# EAGLE design epaper-watch (EAGLE 9.1.0)
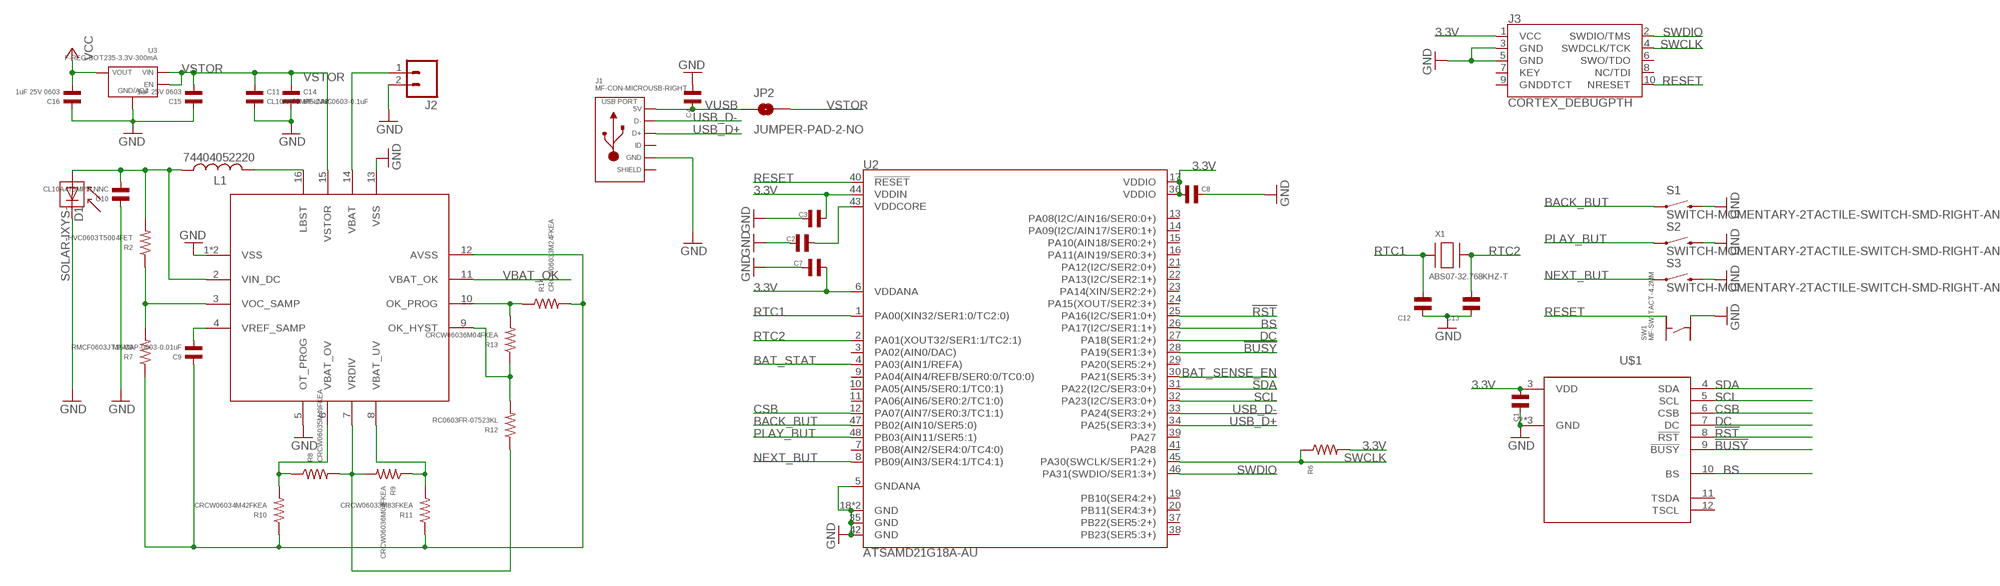
[diagram p0: schematic, sheet 1]

## Parts
C1  0.1uF 0603  CAPACITOR_NP_0603  [C0603]
C2  1uF 0603  CAPACITOR_NP_0603  [C0603]
C3  0.1uF 0603  CAPACITOR_NP_0603  [C0603]
C4  0.1uF 0603  CAPACITOR_NP_0603  [C0603]
C7  0.1uF 0603  CAPACITOR_NP_0603  [C0603]
C8  0.1uF 0603  CAPACITOR_NP_0603  [C0603]
C9  MF-CAP-0603-0.01uF  CAPACITOR_NP_0603  [C0603]
C10  CL10A475MP5LNNC  CAPACITOR_NP_0603  [C0603]
C11  CL10A475MP5LNNC  CAPACITOR_NP_0603  [C0603]
C12  15pF  CAPACITOR_NP_0603  [C0603]
C13  15pF  CAPACITOR_NP_0603  [C0603]
C14  MF-CAP-0603-0.1uF  CAPACITOR_NP_0603  [C0603]
C15  1uF 25V 0603  CAPACITOR_NP_0603  [C0603]
C16  1uF 25V 0603  CAPACITOR_NP_0603  [C0603]
D1  SOLAR-IXYS-  [SOLARBIT-12X1]
J1  MF-CON-MICROUSB-RIGHT  USB_MICRO_RIGHT  [MICROUSB-RIGHT]
J2  M02PTH  [1X02]
J3  CORTEX_DEBUGPTH  [2X5-PTH-1.27MM]
JP2  JUMPER-PAD-2-NO  [PAD-JUMPER-2-NO_NO_SILK]
L1  74404052220  L-USWE-TPC  [POWER-CHOKE_WE-TPC]
R2  HVC0603T5004FET  RESISTOR_0603  [R0603]
R6  1K  RESISTOR_0603  [R0603]
R7  RMCF0603JT15M0  RESISTOR_0603  [R0603]
R8  CRCW06035M49FKEA  RESISTOR_0603  [R0603]
R9  CRCW06036M04FKEA  RESISTOR_0603  [R0603]
R10  CRCW06034M42FKEA  RESISTOR_0603  [R0603]
R11  CRCW06033M83FKEA  RESISTOR_0603  [R0603]
R12  RC0603FR-07523KL  RESISTOR_0603  [R0603]
R13  CRCW06036M04FKEA  RESISTOR_0603  [R0603]
R14  CRCW06033M24FKEA  RESISTOR_0603  [R0603]
S1  SWITCH-MOMENTARY-2TACTILE-SWITCH-SMD-RIGHT-ANGLE  [TACTILE_SWITCH-SMD-RIGHT-ANGLE]
S2  SWITCH-MOMENTARY-2TACTILE-SWITCH-SMD-RIGHT-ANGLE  [TACTILE_SWITCH-SMD-RIGHT-ANGLE]
S3  SWITCH-MOMENTARY-2TACTILE-SWITCH-SMD-RIGHT-ANGLE  [TACTILE_SWITCH-SMD-RIGHT-ANGLE]
SW1  MF-SW-TACT-4.2MM  TACT_4.2MM  [TACT4.2MM]
U1  BQ25504RGTT  BQ25504  [QFN16-3X3MM_1:1_V03]
U2  ATSAMD21G18A-AU  ATSAMD21G-M  [QFN-48]
U3  F-REG-SOT235-3.3V-300mA  TLV70233PDBVR  [SOT-23-5]
U$1  GDEP011TT2  [FH26W-15S-0.3S]
X1  ABS07-32.768KHZ-T  XTAL-3.2X1.5  [XTAL3215]

## Nets
3.3V: C1.P$2 C3.P$2 C7.P$2 C8.P$2 J3.1(VCC) R6.P$2 U2.6(VDDANA) U2.17(VDDIO) U2.36(VDDIO) U2.44(VDDIN) U$1.3(VDD)
!BUSY: U2.28(PA19(SER1:3+)) U$1.9(!BUSY)
!RST: U2.25(PA16(I2C/SER1:0+)) U$1.8(!RST)
BACK_BUT: S1.1 U2.47(PB02(AIN10/SER5:0))
BAT_SENSE_EN: U2.30(PA21(SER5:3+))
BAT_STAT: U2.4(PA03(AIN1/REFA))
BS: U2.26(PA17(I2C/SER1:1+)) U$1.10(BS)
CSB: U2.12(PA07(AIN7/SER0:3/TC1:1)) U$1.6(CSB)
DC: U2.27(PA18(SER1:2+)) U$1.7(DC)
GND: C1.P$1 C2.P$2 C3.P$1 C4.P$2 C7.P$1 C8.P$1 C10.P$1 C11.P$2 C12.P$1 C13.P$1 C14.P$2 C15.P$1 C16.P$1 D1.-(C) J1.5(GND) J2.2 J3.3(GND) J3.5(GND) S1.2 S2.2 S3.2 SW1.P$4 U1.1(VSS) U1.5(OT_PROG) U1.13(VSS) U1.EXT(VSS) U2.5(GNDANA) U2.18(GND) U2.35(GND) U2.42(GND) U2.EP(GND) U3.P$2(GND/ADJ) U$1.2(GND) U$1.EXP1(GND) U$1.EXP2(GND)
N$1: C9.P$2 U1.4(VREF_SAMP)
N$2: L1.2 U1.16(LBST)
N$3: R12.P$2 R13.P$1 U1.9(OK_HYST)
N$4: C9.P$1 R7.P$1 R10.P$1 R11.P$1 R14.P$2 U1.12(AVSS)
N$8: C2.P$1 U2.43(VDDCORE)
N$10: R13.P$2 R14.P$1 U1.10(OK_PROG)
N$12: R8.P$2 R9.P$2 R12.P$1 U1.7(VRDIV)
N$13: R9.P$1 R11.P$2 U1.8(VBAT_UV)
N$14: R8.P$1 R10.P$2 U1.6(VBAT_OV)
N$18: R2.P$1 R7.P$2 U1.3(VOC_SAMP)
NEXT_BUT: S3.1 U2.8(PB09(AIN3/SER4:1/TC4:1))
PLAY_BUT: S2.1 U2.48(PB03(AIN11/SER5:1))
RESET: J3.10(NRESET) SW1.P$2 U2.40(!RESET!)
RTC1: C12.P$2 U2.1(PA00(XIN32/SER1:0/TC2:0)) X1.P$1
RTC2: C13.P$2 U2.2(PA01(XOUT32/SER1:1/TC2:1)) X1.P$2
SCL: U2.32(PA23(I2C/SER3:0+)) U$1.5(SCL)
SDA: U2.31(PA22(I2C/SER3:0+)) U$1.4(SDA)
SOLAR_IN: C10.P$2 D1.+(A) L1.1 R2.P$2 U1.2(VIN_DC)
SWCLK: J3.4(SWDCLK/TCK) R6.P$1 U2.45(PA30(SWCLK/SER1:2+))
SWDIO: J3.2(SWDIO/TMS) U2.46(PA31(SWDIO/SER1:3+))
USB_D+: J1.3(D+) U2.34(PA25(SER3:3+))
USB_D-: J1.2(D-) U2.33(PA24(SER3:2+))
VBAT: J2.1 U1.14(VBAT)
VBAT_OK: U1.11(VBAT_OK)
VCC [power]: C16.P$2 U3.P$5(VOUT)
VSTOR [power]: C11.P$1 C14.P$1 C15.P$2 JP2.2 U1.15(VSTOR) U3.P$1(VIN) U3.P$3(EN)
VUSB: C4.P$1 J1.1(5V) JP2.1
Unconnected: J1.4(ID) J3.6(SWO/TDO) J3.7(KEY) J3.8(NC/TDI) J3.9(GNDDTCT) SW1.P$1 SW1.P$3 U2.3(PA02(AIN0/DAC)) U2.7(PB08(AIN2/SER4:0/TC4:0)) U2.9(PA04(AIN4/REFB/SER0:0/TC0:0)) U2.10(PA05(AIN5/SER0:1/TC0:1)) U2.11(PA06(AIN6/SER0:2/TC1:0)) U2.13(PA08(I2C/AIN16/SER0:0+)) U2.14(PA09(I2C/AIN17/SER0:1+)) U2.15(PA10(AIN18/SER0:2+)) U2.16(PA11(AIN19/SER0:3+)) U2.19(PB10(SER4:2+)) U2.20(PB11(SER4:3+)) U2.21(PA12(I2C/SER2:0+)) U2.22(PA13(I2C/SER2:1+)) U2.23(PA14(XIN/SER2:2+)) U2.24(PA15(XOUT/SER2:3+)) U2.29(PA20(SER5:2+)) U2.37(PB22(SER5:2+)) U2.38(PB23(SER5:3+)) U2.39(PA27) U2.41(PA28) U$1.11(TSDA) U$1.12(TSCL)

## Power pins joined to a net without a drawn wire
SLD: J1.S1(SLD)

## Library data of the parts
C1-C4 C7-C16 = MF_Passives:CAPACITOR_NP: Library: MF_Passives Description: Device for Non-Polarized Capacitors. Manufacture part number (MPN) can be added via Attributes. Check https://factory.macrofab.com/parts for the house parts list.; POPULATE: 1
D1 = SparkFun-Sensors:SOLAR-IXYS
J1 = MF_Connectors:USB: Library: MF_Connectors Description: 5 Pin USB Connectors. SLD is the shield connection. Usually tied to ground through a small ferrite bead.; HOUSEPART: YES; MPN: MF-CON-MICROUSB-RIGHT; POPULATE: 1; URL: https://factory.macrofab.com/part/MF-CON-MICROUSB-RIGHT
J2 = SparkFun-Connectors:M02: Standard 2-pin 0.1" header. Use with - straight break away headers ( PRT-00116) - right angle break away headers (PRT-00553) - swiss pins (PRT-00743) - machine pins (PRT-00117) - female headers (PRT-00115) Molex polarized connector foot print use with: PRT-08233 with associated crimp pins and housings. 2.54_SCREWTERM for use with PRT-10571. 3.5mm Screw Terminal footprints for PRT-08084 5mm Screw Terminal footprints for use with PRT-08432
J3 = SparkFun-Connectors:CORTEX_DEBUG: Cortex Debug Connector Datasheet <http://infocenter.arm.com/help/topic/com.arm.doc.faqs/attached/13634/cortex_debug_connectors.pdf>
JP2 = SparkFun-Passives:JUMPER-PAD-2-NO
L1 = rcl:L-US: INDUCTOR, American symbol
R2 R6-R14 = MF_Passives:RESISTOR: Library: MF_Passives Description: Device for Resistors. Manufacture part number (MPN), Voltage, Tolerance, and Wattage Rating can be added via Attributes. Check https://factory.macrofab.com/parts for the house parts list.; POPULATE: 1
S1-S3 = SparkFun-Electromechanical:SWITCH-MOMENTARY-2: Various NO switches- pushbuttons, reed, etc; PROD_ID: COMP-12265
SW1 = MF_Switches:TACT: Library: MF_Switches Description: Device for Tact Switches. Manufacture part number (MFG#) can be added via Attributes.; HOUSEPART: YES; MPN: MF-SW-TACT-4.2MM; POPULATE: 1; URL: https://factory.macrofab.com/part/MF-SW-TACT-4.2MM
U1 = sonik:BQ25504
U2 = SparkFun-DigitalIC:ATSAMD21G: Atmel SAMD21G SMART ARM-Based Microcontroller The Atmel ® | SMART ™ SAM D21 is a series of low-power microcontrollers using the 32-bit ARM ® Cortex ® -M0+ processor, and ranging from 32- to 64-pins with up to 256KB Flash and 32KB of SRAM. The SAM D21 devices operate at a maximum frequency of 48MHz and reach 2.46 CoreMark/MHz. They are designed for simple and intuitive migration with identical peripheral modules, hex compatible code, identical linear address map and pin compatible migration paths between all devices in the product series. All devices include intelligent and flexible peripherals, Atmel Event System for inter-peripheral signaling, and support for capacitive touch button, slider and wheel user interfaces.; PROD_ID: IC-13064
U3 = MF_IC_Power:TLV702: Manufacturer Part #: TLV702 Manufacturer: Texas Instruments Description: LDO Voltage Regulators; HOUSEPART: YES; MPN: F-REG-SOT235-3.3V-300mA; POPULATE: 1; URL: https://factory.macrofab.com/part/MF-REG-SOT235-3.3V-300mA
U$1 = sonik:GDEP011TT2
X1 = adafruit:XTAL: Low cost SMT crystals, no capacitors included http://www.ladyada.net/library/eagle

## Board
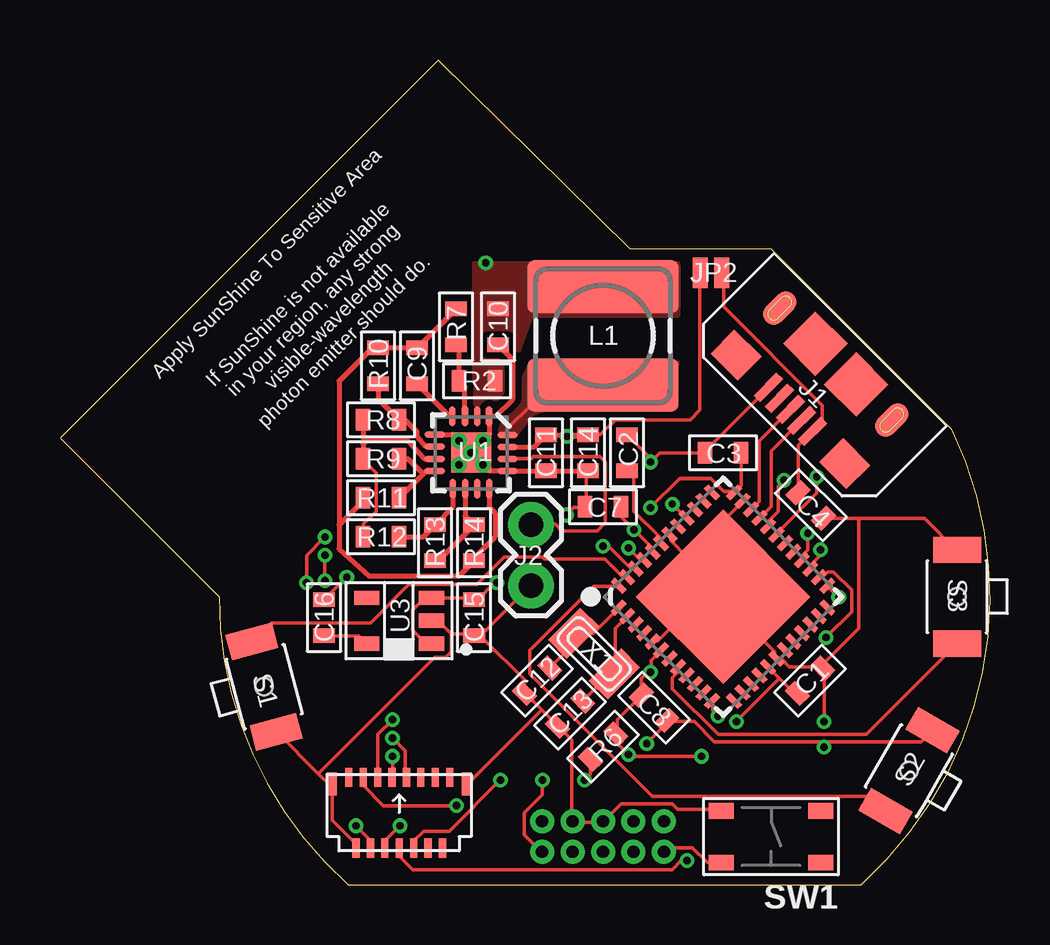
[diagram p1: board, top side]
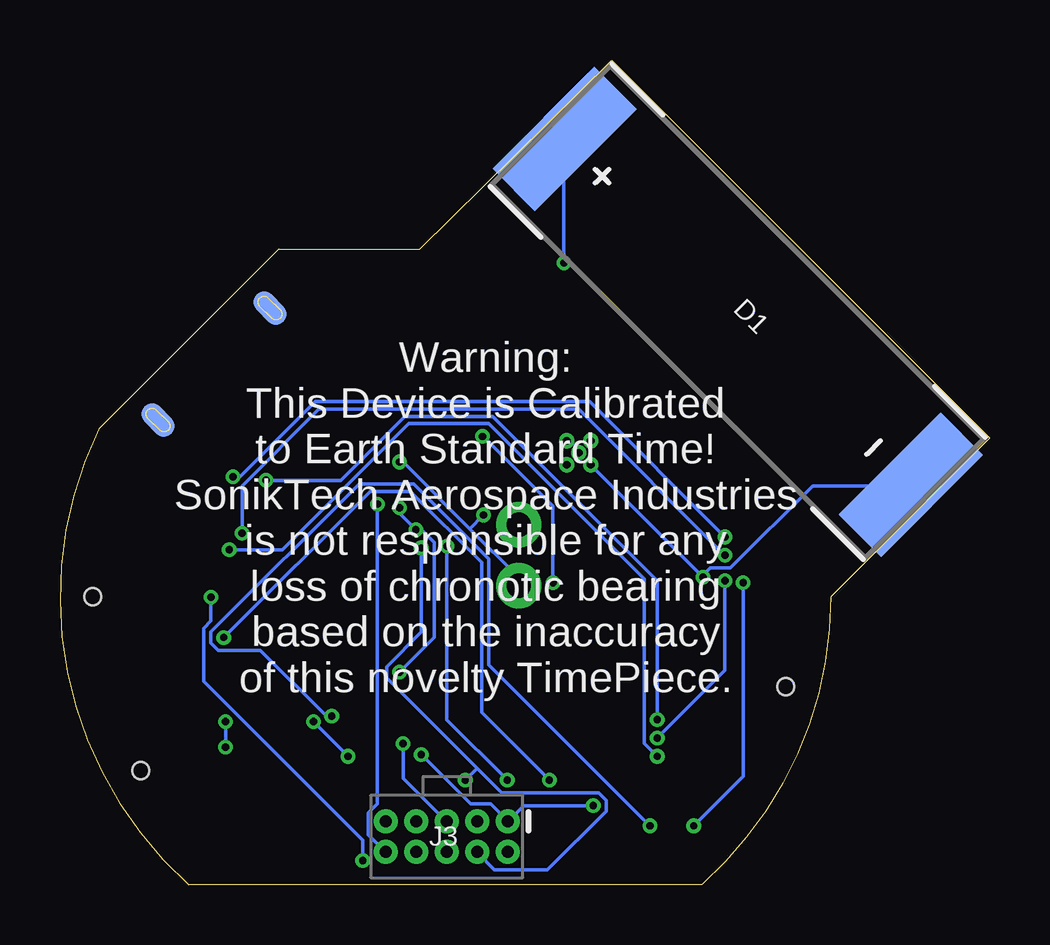
[diagram p2: board, bottom side, seen from below]

Size 38.74 x 34.38 mm. Coordinates in mm from the lower left corner, seen from the top.
Outline: 29.62,26.5 37.12,19 arc-74 33.38,0 12,0 arc-48 6.62,12 0,18.62 15.75,34.38 23.75,26.5 29.62,26.5
Copper layers (1*16): Top 0.035mm / dielectric 1.5mm / Bottom 0.035mm
Design rules "MF_Standard_2_Layer_6mil": minimum track width 6mil, minimum drill 12mil, track to track 6mil, track to pad 6mil, pad to pad 5mil, via to via 6mil, smd to smd 0mil, copper to edge 20mil, drill to drill 10mil, minimum pad ring 6mil, minimum via ring 6mil, stop-mask expansion 2mil, vias tented up to drill 25mil, thermal gap 10mil

### Footprints (pad centres in the part's own frame; a part is rotated, then mirrored left to right if it is on the bottom)
C0603 = smd 0.6 x 0.9: P$1 -0.75,0; P$2 0.75,0
SOLARBIT-12X1 = smd 2.5 x 6: + -10.2,0; - 10.2,0
MICROUSB-RIGHT = smd 0.4 x 1.35: 1 -1.3,1.27; 2 -0.65,1.27; 3 0,1.27; 4 0.65,1.27; 5 1.3,1.27 | smd 0.9 x 1.6: S1 -3.3,-1.4; S2 3.3,-1.4 | smd 1.6 x 1.4: S3 -3.2,1.27; S4 3.2,1.27 | smd 1.9 x 1.9: S5 -1.2,-1.405; S6 1.2,-1.405 | smd 0.9 x 1.6 bottom: S7 -3.3,-1.4; S8 3.3,-1.4
1X02 = drill 1.016 pad 1.88: 1 0,0; 2 2.54,0
2X5-PTH-1.27MM = drill 0.508 pad 1: 1 -2.54,-0.635; 2 -2.54,0.635; 3 -1.27,-0.635; 4 -1.27,0.635; 5 0,-0.635; 6 0,0.635; 7 1.27,-0.635; 8 1.27,0.635; 9 2.54,-0.635; 10 2.54,0.635
PAD-JUMPER-2-NO_NO_SILK = smd 0.635 x 1.27: 1 -0.45,0; 2 0.45,0
POWER-CHOKE_WE-TPC = smd 6.3 x 2.2: 1 0,2.05; 2 0,-2.05
R0603 = smd 0.6 x 0.9: P$1 -0.75,0; P$2 0.75,0
TACTILE_SWITCH-SMD-RIGHT-ANGLE = smd 1.1 x 2: 1 -1.95,0; 2 1.95,0 | hole 0.7: 0,0
TACT4.2MM = smd 1.05 x 0.65: P$1 -2.075,1.075; P$2 2.075,1.075; P$3 -2.075,-1.075; P$4 2.075,-1.075
QFN16-3X3MM_1:1_V03 = smd 0.85 x 0.28: 1 -1.524,0.75; 2 -1.524,0.253; 3 -1.529,-0.25; 4 -1.527,-0.774; 9 1.503,-0.77; 10 1.498,-0.245; 11 1.498,0.255; 12 1.495,0.755 | smd 0.28 x 0.85: 5 -0.765,-1.513; 6 -0.265,-1.513; 7 0.263,-1.513; 8 0.763,-1.513; 13 0.758,1.518; 14 0.258,1.518; 15 -0.247,1.518; 16 -0.742,1.518 | smd 1.68 x 1.68: EXT -0.009,0.008
QFN-48 = smd 0.7 x 0.25: 1 -3.4,2.75; 2 -3.4,2.25; 3 -3.4,1.75; 4 -3.4,1.25; 5 -3.4,0.75; 6 -3.4,0.25; 7 -3.4,-0.25; 8 -3.4,-0.75; 9 -3.4,-1.25; 10 -3.4,-1.75; 11 -3.4,-2.25; 12 -3.4,-2.75; 25 3.4,-2.75; 26 3.4,-2.25; 27 3.4,-1.75; 28 3.4,-1.25; 29 3.4,-0.75; 30 3.4,-0.25; 31 3.4,0.25; 32 3.4,0.75; 33 3.4,1.25; 34 3.4,1.75; 35 3.4,2.25; 36 3.4,2.75 | smd 0.25 x 0.7: 13 -2.75,-3.4; 14 -2.25,-3.4; 15 -1.75,-3.4; 16 -1.25,-3.4; 17 -0.75,-3.4; 18 -0.25,-3.4; 19 0.25,-3.4; 20 0.75,-3.4; 21 1.25,-3.4; 22 1.75,-3.4; 23 2.25,-3.4; 24 2.75,-3.4; 37 2.75,3.4; 38 2.25,3.4; 39 1.75,3.4; 40 1.25,3.4; 41 0.75,3.4; 42 0.25,3.4; 43 -0.25,3.4; 44 -0.75,3.4; 45 -1.25,3.4; 46 -1.75,3.4; 47 -2.25,3.4; 48 -2.75,3.4 | smd 5.15 x 5.15: EP 0,0
SOT-23-5 = smd 1.05 x 0.6: P$1 -1.35,0.95; P$2 -1.35,0; P$3 -1.35,-0.95; P$4 1.35,-0.95; P$5 1.35,0.95
FH26W-15S-0.3S = smd 0.3 x 0.8: 1 2.1,-1.475; 2 1.8,1.475; 3 1.5,-1.475; 4 1.2,1.475; 5 0.9,-1.475; 6 0.6,1.475; 7 0.3,-1.475; 8 0,1.475; 9 -0.3,-1.475; 10 -0.6,1.475; 11 -0.9,-1.475; 12 -1.2,1.475; 13 -1.5,-1.475; 14 -1.8,1.475; 15 -2.1,-1.475 | smd 0.4 x 0.95: EXP1 -2.8,-1.2; EXP2 2.8,-1.2
XTAL3215 = smd 1.1 x 1.9: P$1 1.2,0; P$2 -1.2,0

### Placement (x,y rotation side)
C1  31.25,8.5 225 top
C2  23.62,18 90 top
C3  27.62,18 0 top
C4  31.29,15.81 315 top
C7  22.62,15.75 0 top
C8  24.75,7.38 135 top
C9  14.88,21.62 270 top
C10  18.25,23.25 90 top
C11  20.25,18 270 top
C12  19.88,8.5 45 top
C13  21.25,7.12 45 top
C14  22,18 270 top
C15  17.25,11.12 90 top
C16  11,11.12 270 top
D1  10.5,23.88 315 bottom
J1  31.33,20.71 135 top
J2  19.62,15 270 top
J3  22.62,2 180 bottom
JP2  27.12,25.5 180 top
L1  22.62,22.88 0 top
R2  17.38,21 0 top
R6  22.62,5.75 45 top
R7  16.5,23.25 270 top
R8  13.38,19.38 180 top
R9  13.38,17.75 180 top
R10  13.25,21.62 270 top
R11  13.38,16.12 0 top
R12  13.38,14.5 0 top
R13  15.62,14.25 270 top
R14  17.25,14.25 270 top
S1  8.5,8.25 285 top
S2  35.38,4.75 60 top
S3  37.38,12 90 top
SW1  29.62,2 180 top
U1  17.12,18 270 top
U2  27.62,12 45 top
U3  14.12,11 180 top
U$1  14.13,3 180 top
X1  22.25,9.62 135 top

### Tracks (layer width: path | path; a pad name or v marks a point on that pad's centre or on a via)
3.3V  (via drill 0.3)
  Top 0.152: C3.P$2 28.38,16.64 U2.36 28.03,16.39 27.65,16.39 27.11,16.93 25.82,16.93 v24.6,15.71 | U2.17 29.98,8.59 | 29.98,8.59 30.59,7.97 C1.P$2 | U2.6 24.62,9.35 24.62,9 24.5,8.88 | 24.5,8.88 24.22,8.6 C8.P$2 24.22,7.86 23.23,6.87 23.23,6.34 R6.P$2 23.23,6.26 23.23,5.88 v23.68,5.42 23.76,5.34 v26.73,5.34 | U2.44 24.68,13.88 24.68,14.03 v23.91,14.79 23.38,15.33 23.38,15.71 C7.P$2 | v16.52,3.29 13.47,3.29 12.64,4.13 12.64,4.43 U$1.3 | v28.18,6.79 29.98,8.59 | v24.6,8.85 24.52,8.85 24.5,8.88
  Bottom 0.152: v24.6,15.71 24.6,15.48 v23.91,14.79 23.68,14.79 23.15,14.26 23.15,10.3 v24.6,8.85 | v16.52,3.29 19.42,3.29 20.03,2.68 J3.1 20.1,2.68 20.79,3.36 21.63,3.36 v23.68,5.42 | v26.73,5.34 v28.18,6.79
!BUSY  (via drill 0.3)
  Top 0.152: v31.15,14.64 31.15,13.96 30.92,13.73 30.92,13.57 U2.28 | v11.04,12.66 v11.04,13.73 | v13.86,6.11 14.39,5.57 14.39,4.51 U$1.9
  Bottom 0.152: v31.15,14.64 31.15,16.62 27.95,19.82 17.13,19.82 v11.04,13.73 | v11.04,12.66 11.04,8.93 v13.86,6.11
!RST  (via drill 0.3)
  Top 0.152: v32.45,11.97 31.99,12.43 U2.25 | v26.12,1 25.89,1 25.51,0.62 14.69,0.62 14.16,1.15 14.16,1.46 U$1.8
  Bottom 0.152: v32.45,11.97 32.45,10.98 32.75,10.68 32.75,8.47 26.12,1.84 v26.12,1
BACK_BUT
  Top 0.152: U2.47 23.61,12.89 23.38,12.89 22.7,13.57 20.18,13.57 20.1,13.65 18.5,13.65 17.36,12.51 14.54,12.51 12.94,10.91 8.83,10.91 8.06,10.15 S1.1
BS  (via drill 0.3)
  Top 0.152: v31.91,10.3 32.98,11.37 32.98,12.28 32.22,13.04 31.99,13.04 31.84,12.89 31.69,12.89 U2.26 | v18.35,4.36 16.22,2.22 15.15,2.22 14.77,1.84 14.77,1.53 U$1.10
  Bottom 0.152: v31.91,10.3 25.82,16.39 24.14,16.39 21.17,13.42 21.17,7.17 v18.35,4.36
CSB  (via drill 0.3)
  Top 0.152: v27.42,7.02 27.19,7.25 27.19,7.63 U2.12 | v14.16,2.45 13.55,1.84 13.55,1.53 U$1.6
  Bottom 0.152: v27.42,7.02 27.65,7.02 30.39,9.77 32.14,9.77 32.45,10.07 32.45,10.53 26.28,16.7 23.99,16.7 20.87,13.57 20.87,9.15 v14.16,2.45
DC  (via drill 0.3)
  Top 0.152: v31.69,13.96 31.69,13.73 31.3,13.35 31.3,13.19 U2.27 | v13.86,5.34 13.86,4.51 U$1.7
  Bottom 0.152: v31.69,13.96 29.48,13.96 24.22,19.21 20.87,19.21 14.39,12.74 14.39,5.88 v13.86,5.34
GND  (via drill 0.3, 0.33)
  Top 0.152: v17.13,18 16.68,17.54 v16.62,17.5 | v17.13,18 v17.12,18 | v16.62,18.5 16.68,18.45 17.06,18.07 v17.12,18 | v17.12,18 17.21,18.07 17.59,18.45 v17.62,18.5 | C14.P$2 21.93,17.16 21.93,15.79 C7.P$1 21.86,15.71 21.4,15.71 v21.09,15.4 | v11.95,12.81 11.04,11.9 C16.P$1 | 23.61,18.76 C2.P$2 24.6,17.77 v24.6,17.61 24.98,18 26.81,18 C3.P$1 26.89,18.07 29.48,20.66 J1.5 | v17.13,18 17.59,17.54 v17.62,17.5 | v17.13,18 U1.EXT | 33.29,15.25 36.03,15.25 37.33,13.96 S3.2 | 33.29,15.25 31.84,15.25 C4.P$2 | C1.P$1 31.76,9.08 30.39,9.08 30.09,9.38 29.86,9.38 U2.18 29.78,9.46 29.78,9.69 27.57,11.9 U2.EP | U2.5 24.75,10.15 24.91,10.15 26.73,11.97 27.57,11.97 U2.EP | 26.12,13.65 26.66,13.12 26.66,11.97 U2.EP | 26.12,13.65 25.44,14.34 25.44,14.57 U2.42 | 26.12,13.65 28.41,15.94 U2.35 | 26.12,13.65 U2.EP | 33.29,15.25 33.29,10.68 31.76,9.15 C1.P$1 | 31.84,5.96 35.88,5.96 36.34,6.41 S2.2 | 31.84,5.96 27.27,5.96 26.43,6.79 25.29,6.79 C8.P$1 25.29,6.72 v24.45,5.88 | U$1.2 12.33,1.53 12.33,1.69 11.34,2.68 11.34,4.13 U$1.EXP2 11.27,4.13 10.77,4.62 | 10.77,4.62 9.05,6.34 S1.2 | SW1.P$4 27.5,3.14 25.74,3.14 25.51,3.36 23.38,3.36 22.7,2.68 J3.5 22.62,2.6 21.4,2.6 J3.3 21.32,2.68 21.32,6.03 20.79,6.57 C13.P$1 20.71,6.64 20.07,7.29 | 20.07,7.29 19.42,7.94 C12.P$1 19.34,8.01 19.34,8.55 17.67,10.22 17.67,10.45 C15.P$1 | 20.07,7.29 16.98,4.2 U$1.EXP1 | 16.29,10.45 17.21,10.45 C15.P$1 | 16.29,10.45 15.76,10.98 15.53,10.98 U3.P$2 | C15.P$1 17.29,10.45 17.59,10.45 19.57,12.43 J2.2 | 10.77,4.62 15.61,9.46 16.07,9.46 16.29,9.69 16.29,10.45 | v31.84,6.79 31.84,9 C1.P$1 | 31.84,5.96 v31.84,5.73
  Top 0.203: C10.P$1 18.88,21.88 18.88,20.25 18.15,19.52 U1.1 17.88,18.75 v17.62,18.5 | U1.5 16.36,18.77 v16.62,18.5 | v17.62,17.5 17.88,17.24 U1.13 C11.P$2 C14.P$2
  Bottom 0.152: v16.62,17.5 16.6,17.46 v11.95,12.81 11.95,12.89 11.65,13.19 10.81,13.19 7.38,16.62 3.34,16.62 D1.- | v24.6,17.61 24.45,17.61 21.67,14.83 | 21.67,14.83 19.65,12.81 19.65,12.51 J2.2 | v24.45,5.88 24.45,4.43 22.7,2.68 J3.5 | v31.84,5.73 v31.84,6.79 | 21.67,14.83 v21.09,15.4
N$1
  Top 0.203: U1.4 16.22,19.53 C9.P$2
N$2
  Top 0.152: U1.16 18.64,19.02 19.62,20 21.93,20 L1.2
  pour Top (isolate 0.254, no thermals): 18.25,18.75 19.62,21.75 25.75,21.75 19.62,19.62 18.88,18.62
N$3
  Top 0.203: R12.P$2 15.12,14.5 R13.P$1 16.36,15.73 U1.9
N$4
  Top 0.203: R7.P$1 C9.P$1 R10.P$1 13,22.38 11.62,21 11.62,15 | 11.62,15 11.62,14 12.88,12.88 16.62,12.88 R14.P$2 17.25,13.62 18.12,14.5 18.12,15.5 17.88,15.74 U1.12 | R11.P$1 12.62,16 11.62,15
N$8
  Top 0.152: U2.43 24.98,14.26 24.98,14.49 23.91,15.56 23.91,17 23.68,17.23 C2.P$1
N$10
  Top 0.203: U1.10 16.88,15.37 R14.P$1 15.75,13.5 R13.P$2
N$12
  Top 0.152: R12.P$1 12.64,14.57 12.64,15.02 13.17,15.56 13.17,17.16 12.64,17.69 R9.P$2
  Top 0.203: 15.6,17.75 U1.7 15.2,17.74 14.5,18.5 12.75,18.5 12.62,18.38 | R8.P$2 12.62,18.38 | 12.62,18.38 R9.P$2
N$13
  Top 0.203: U1.8 15.24,17.24 15.12,17.12 | 15.12,17.12 R11.P$2 | R9.P$1 14.5,17.75 15.12,17.12
N$14
  Top 0.203: U1.6 15.23,18.27 14.88,18.69 14.88,18.88 14.38,19.38 R8.P$1 13.25,20.25 R10.P$2
N$18
  Top 0.203: U1.3 16.88,20.75 R2.P$1 16.62,22.38 R7.P$2
NEXT_BUT
  Top 0.152: U2.8 25.74,9 25.74,8.85 25.51,8.62 25.51,8.16 27.42,6.26 33.59,6.26 37.33,9.99 S3.1
PLAY_BUT
  Top 0.152: U2.48 23.23,12.43 22.24,12.43 19.57,9.77 19.57,8.77 24.68,3.67 33.82,3.67 34.35,3.14 S2.1
RESET  (via drill 0.3)
  Top 0.152: v25.51,15.86 26.05,15.33 U2.40 | SW1.P$2 27.5,0.93 26.96,0.93 26.35,1.53 25.36,1.53 25.21,1.38 J3.10
  Bottom 0.152: v25.51,15.86 25.51,3.36 25.89,2.98 25.89,2.07 25.21,1.38 J3.10
RTC1
  Top 0.152: U2.1 22.21,10.47 X1.P$1 21.4,10.03 C12.P$2
RTC2
  Top 0.152: U2.2 23.12,10.68 23.12,8.8 X1.P$2 22.9,8.78 C13.P$2
SCL  (via drill 0.3)
  Top 0.152: v30.16,16.85 29.93,16.62 29.93,15.56 29.55,15.18 29.55,14.95 U2.32 | v13.86,6.87 13.25,6.26 13.25,4.51 U$1.5
  Bottom 0.152: v30.16,16.85 27.04,16.85 24.37,19.52 20.71,19.52 13.86,12.66 v13.86,6.87
SDA  (via drill 0.3)
  Top 0.152: v31.53,17 31.53,16.32 29.86,14.64 U2.31 | v11.04,14.49 10.27,13.73 v10.27,12.58 | v12.33,2.45 12.87,1.92 12.87,1.53 U$1.4
  Bottom 0.152: v31.53,17 31.23,17 28.11,20.13 16.68,20.13 v11.04,14.49 | v10.27,12.58 10.27,4.51 v12.33,2.45
SOLAR_IN  (via drill 0.3)
  Top 0.152: v17.74,25.92 17.74,25.88
  Bottom 0.152: v17.74,25.92 17.74,31.02 D1.+
  pour Top (isolate 0.254, no thermals): 25.75,23.75 25.75,25.88 17.25,25.88 17.25,19.12 18.5,20.62 19.62,23.75
SWCLK  (via drill 0.3)
  Top 0.152: v23.68,14.03 24.14,13.57 24.3,13.57 U2.45 | v21.86,4.36 22.09,4.58 22.09,5.19 R6.P$1
  Bottom 0.152: v23.68,14.03 23.68,10.53 25.13,9.08 25.13,8.62 21.36,4.85 | 21.36,4.85 20.33,3.82 16.29,3.82 15.99,3.52 15.99,3.06 18.43,0.62 20.64,0.62 21.32,1.31 J3.4 | 21.36,4.85 v21.86,4.36
SWDIO  (via drill 0.3)
  Top 0.152: v22.62,14.11 22.85,14.11 23.76,13.19 23.91,13.19 U2.46 | v20.1,4.36 20.1,3.75 19.34,2.98 19.34,2.07 20.03,1.38 J3.2
  Bottom 0.152: v22.62,14.11 22.62,6.87 v20.1,4.36
USB_D+
  Top 0.152: J1.3 29.12,18.5 29.12,15.97 U2.34
USB_D-
  Top 0.152: J1.2 29.62,18.08 29.62,15.77 U2.33
VBAT
  Top 0.152: U1.14 18.66,17.77 19.65,17.77 19.72,17.84 22.49,17.84 22.72,17.61 22.72,15.09 22.38,14.75 20.91,14.75 20.64,15.02 19.65,15.02 J2.1
VCC
  Top 0.152: C16.P$2 12.45,10.38 U3.P$5
VSTOR  (via drill 0.3)
  Top 0.152: U3.P$1 15.46,10.07 15.23,10.07 14.69,10.6 14.69,11.44 15.15,11.9 15.46,11.9 U3.P$3 17.18,11.95 C15.P$2 17.36,11.82 18.12,12.58 v18.2,12.58 | JP2.2 26.66,25.46 26.66,19.78 26.25,19.38 23.12,19.38 22.51,18.76 22.09,18.76 C14.P$1
  Top 0.203: U1.15 19.75,18.25 C11.P$1 C14.P$1 21.78,18.68 v21.13,18.68 | 17.29,11.82 C15.P$2
  Bottom 0.152: v18.2,12.58 18.2,15.79 21.09,18.68 v21.13,18.68
VUSB
  Top 0.152: C4.P$1 30.76,18.29 J1.1 31.38,18.91 31.76,19.29 31.76,19.98 27.65,24.09 27.65,25.46 JP2.1

### Text on the board
tNames: Apply SunShine To Sensitive Area / / If SunShine is not available / in your region, any strong / visible-wavelength / photon emitter should do.
bNames: Warning: / This Device is Calibrated / to Earth Standard Time! / SonikTech Aerospace Industries / is not responsible for any / loss of chronotic bearing / based on the inaccuracy / of this novelty TimePiece.